# EAGLE design Pyr0-Piezo_Orion_Adapter_v1.0.0 (EAGLE 9.6.2)
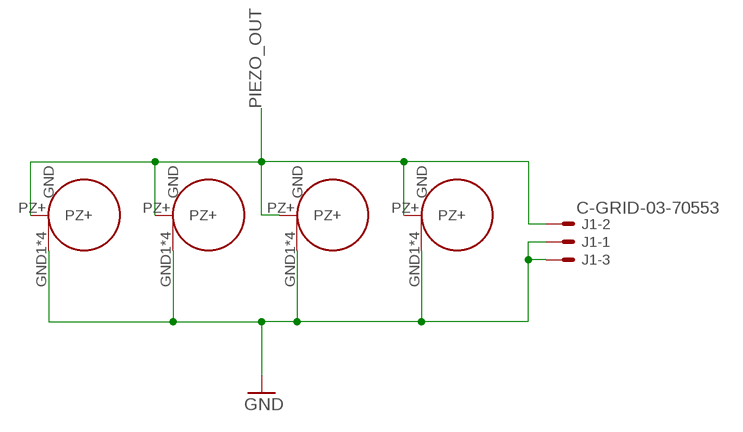
[diagram p0: schematic, sheet 1]

## Parts
J1  C-GRID-03-70553  [70553-03]
U$1  PIEZO-DISK12MM  [PIEZO-DISK-12MM]
U$2  PIEZO-DISK12MM  [PIEZO-DISK-12MM]
U$3  PIEZO-DISK12MM  [PIEZO-DISK-12MM]
U$4  PIEZO-DISK12MM  [PIEZO-DISK-12MM]

## Nets
GND: J1.1 J1.3 U$1.GND1(GND) U$1.GND2(GND) U$1.GND3(GND) U$1.GND4(GND) U$2.GND1(GND) U$2.GND2(GND) U$2.GND3(GND) U$2.GND4(GND) U$3.GND1(GND) U$3.GND2(GND) U$3.GND3(GND) U$3.GND4(GND) U$4.GND1(GND) U$4.GND2(GND) U$4.GND3(GND) U$4.GND4(GND)
PIEZO_OUT: J1.2 U$1.PZ+ U$2.PZ+ U$3.PZ+ U$4.PZ+

## Library data of the parts
J1 = PiezoFFC:C-GRID-03: CONNECTOR wire to board 2.54 mm (0.100") pitch header; MF: MOLEX; OC_FARNELL: unknown; OC_NEWARK: unknown
U$1-U$4 = PiezoFFC:PIEZO-DISK

## Board
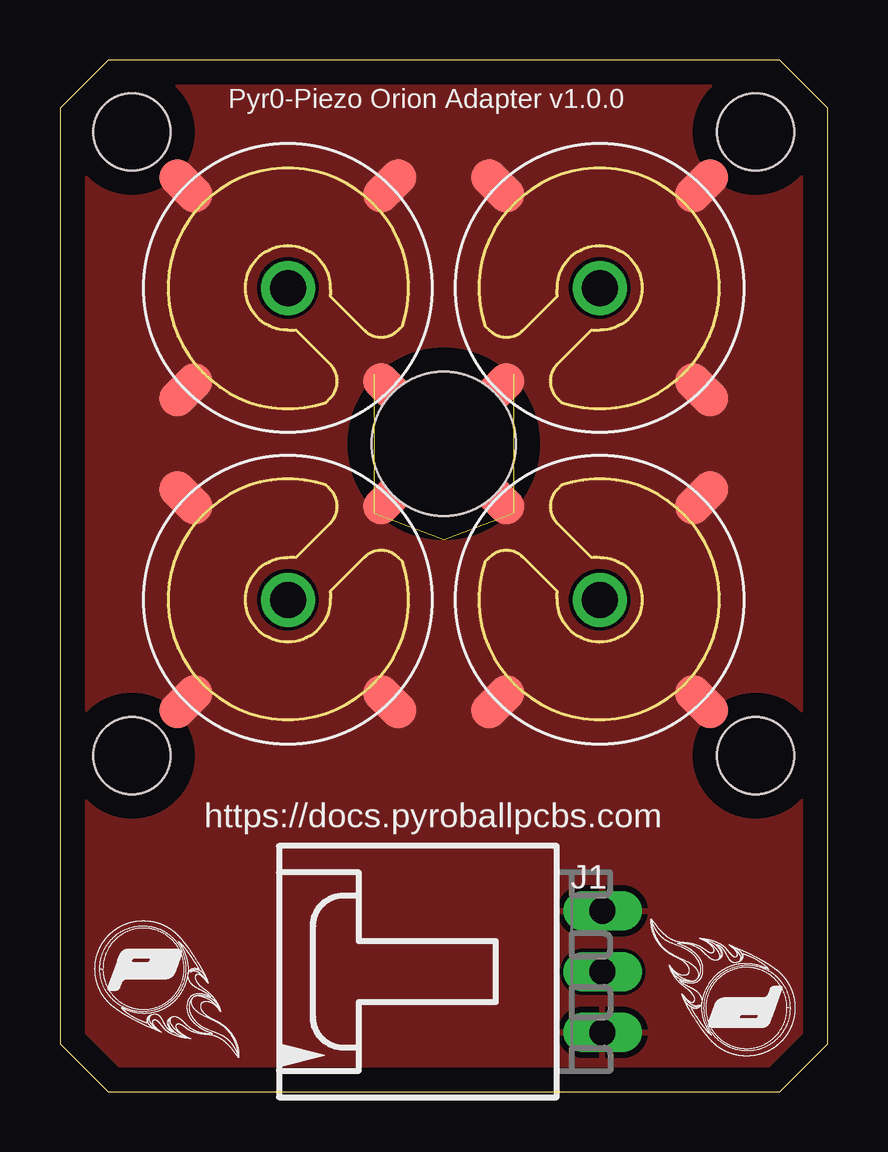
[diagram p1: board, top side]
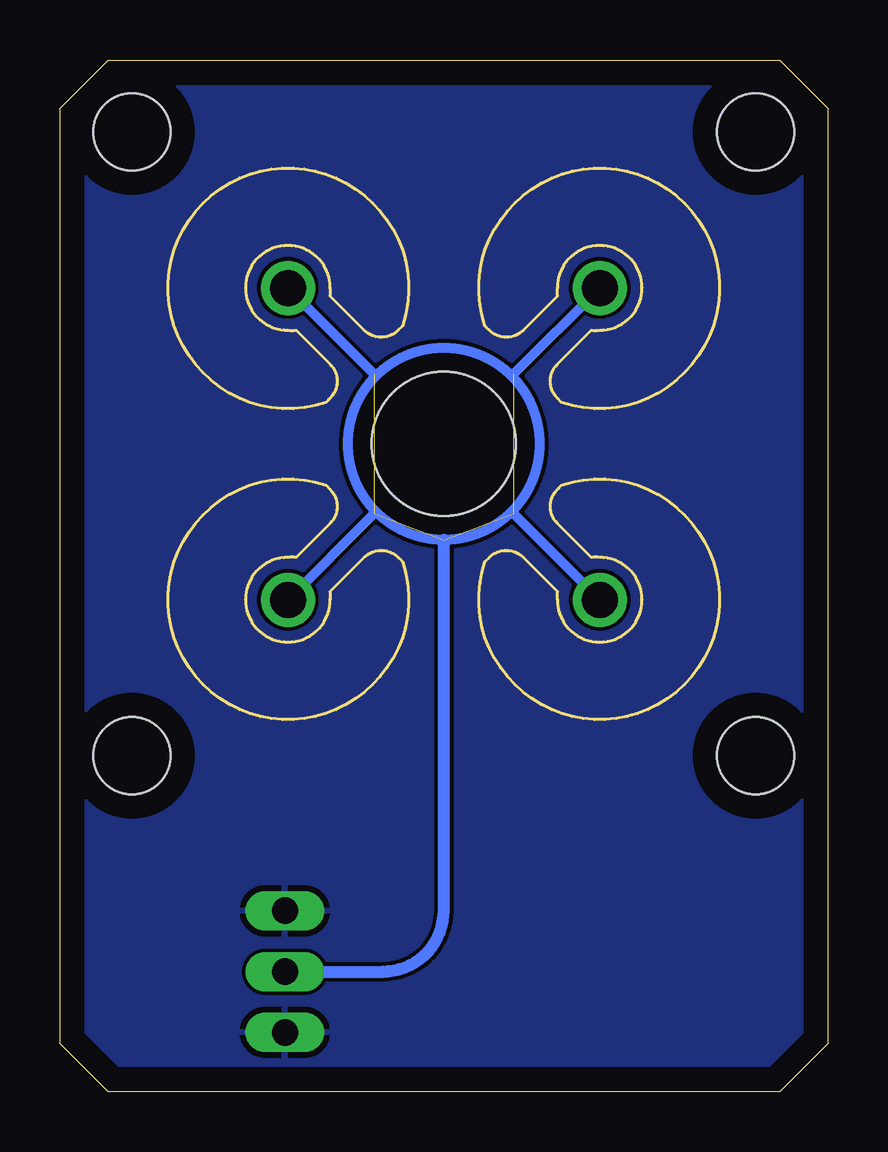
[diagram p2: board, bottom side, seen from below]

Size 32 x 43 mm. Coordinates in mm from the lower left corner, seen from the top.
Outline: 2,0 30,0 32,2 32,41 30,43 2,43 0,41 0,2 2,0
Copper layers (1*16): Top 0.035mm / dielectric 1.5mm / Bottom 0.035mm
Design rules "default": minimum track width 6mil, minimum drill 0.35mm, track to track 6mil, track to pad 6mil, pad to pad 6mil, via to via 6mil, smd to smd 6mil, copper to edge 40mil, drill to drill 6mil, minimum pad ring 10mil, minimum via ring 8mil, stop-mask expansion 4mil, vias tented up to drill 0mil, thermal gap 10mil
Holes 6 mm at 16,27
Holes 3.2 mm at 29,40 29,14 3,14 3,40

### Footprints (pad centres in the part's own frame; a part is rotated, then mirrored left to right if it is on the bottom)
70553-03 = drill 1.092 long: 1 -2.54,-7.62; 2 0,-7.62; 3 2.54,-7.62
PIEZO-DISK-12MM = smd 1.5 x 2.5: GND1 0,6; GND3 0,-6 | smd 2.5 x 1.5: GND2 6,0; GND4 -6,0 | drill 1.5: PZ+ 0,0

### Placement (x,y rotation side)
J1  15,5 90 top
U$1  9.5,20.5 315 top
U$2  22.5,20.5 45 top
U$3  9.5,33.5 225 top
U$4  22.5,33.5 135 top
U$5  [LOGO-PYR0BALL-SS-6MM]  3.3,5.1 0 top
U$6  [LOGO-PYR0BALL-SS-6MM]  28.8,3.5 180 top

### Tracks (layer width: path | path; a pad name or v marks a point on that pad's centre or on a via)
GND
  pour Bottom: 2,0 0,2 0,41 2,43 30,43 32,41 32,2 30,0
  pour Top: 2,0 0,2 0,41 2,43 30,43 32,41 32,2 30,0
PIEZO_OUT  (4 unrouted)
  Bottom 0.406: U$1.PZ+ 13.1,24.1 | U$3.PZ+ 13.1,29.9 | U$4.PZ+ 18.9,29.9 | U$2.PZ+ 18.9,24.1
  Bottom 0.508: J1.2 18.54,5 arc-90 16,7.54 16,23
(copper drawn outside any net)
  shapes: Bottom circle x1

### Text on the board
tPlace: Pyr0-Piezo Orion Adapter v1.0.0 | https://docs.pyroballpcbs.com